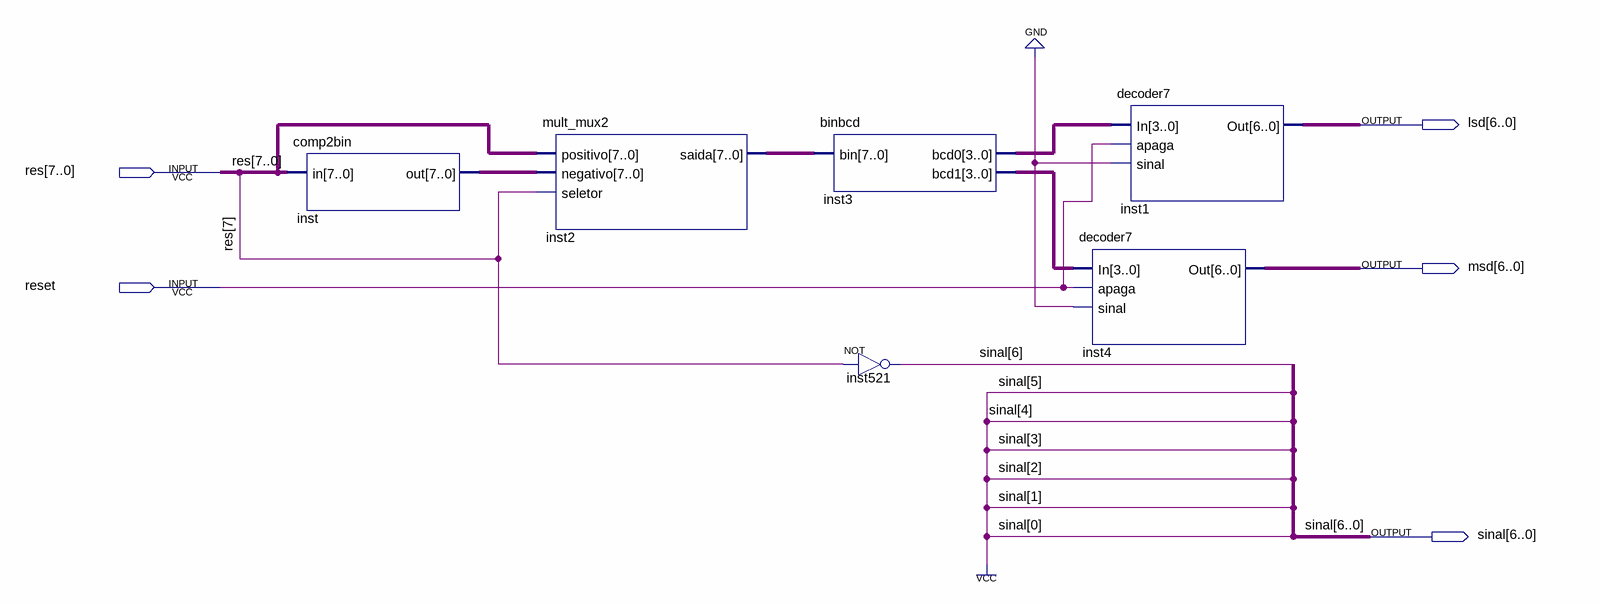
[diagram p0: schematic sheet]
// Quartus schematic out_res.bdf as structural Verilog: 6 symbols, 5 pins
module out_res (
  input  [7:0] res,
  input  reset,
  output [6:0] lsd,
  output [6:0] msd,
  output [6:0] sinal
);

  wire [3:0] inst3_bcd0, inst3_bcd1;
  wire [7:0] inst2_saida, inst_out;

  comp2bin inst (.in(res), .out(inst_out));
  mult_mux2 inst2 (.positivo(res), .negativo(inst_out), .seletor(res[7]), .saida(inst2_saida));
  binbcd inst3 (.bin(inst2_saida), .bcd0(inst3_bcd0), .bcd1(inst3_bcd1));
  not inst521 (sinal[6], res[7]);
  decoder7 inst1 (.In(inst3_bcd0), .apaga(reset), .sinal(1'b0), .Out(lsd));
  decoder7 inst4 (.In(inst3_bcd1), .apaga(reset), .sinal(1'b0), .Out(msd));

  assign sinal[5:0] = {6{1'b1}};
endmodule
